# EAGLE schematic scema (EAGLE 7.1.0)
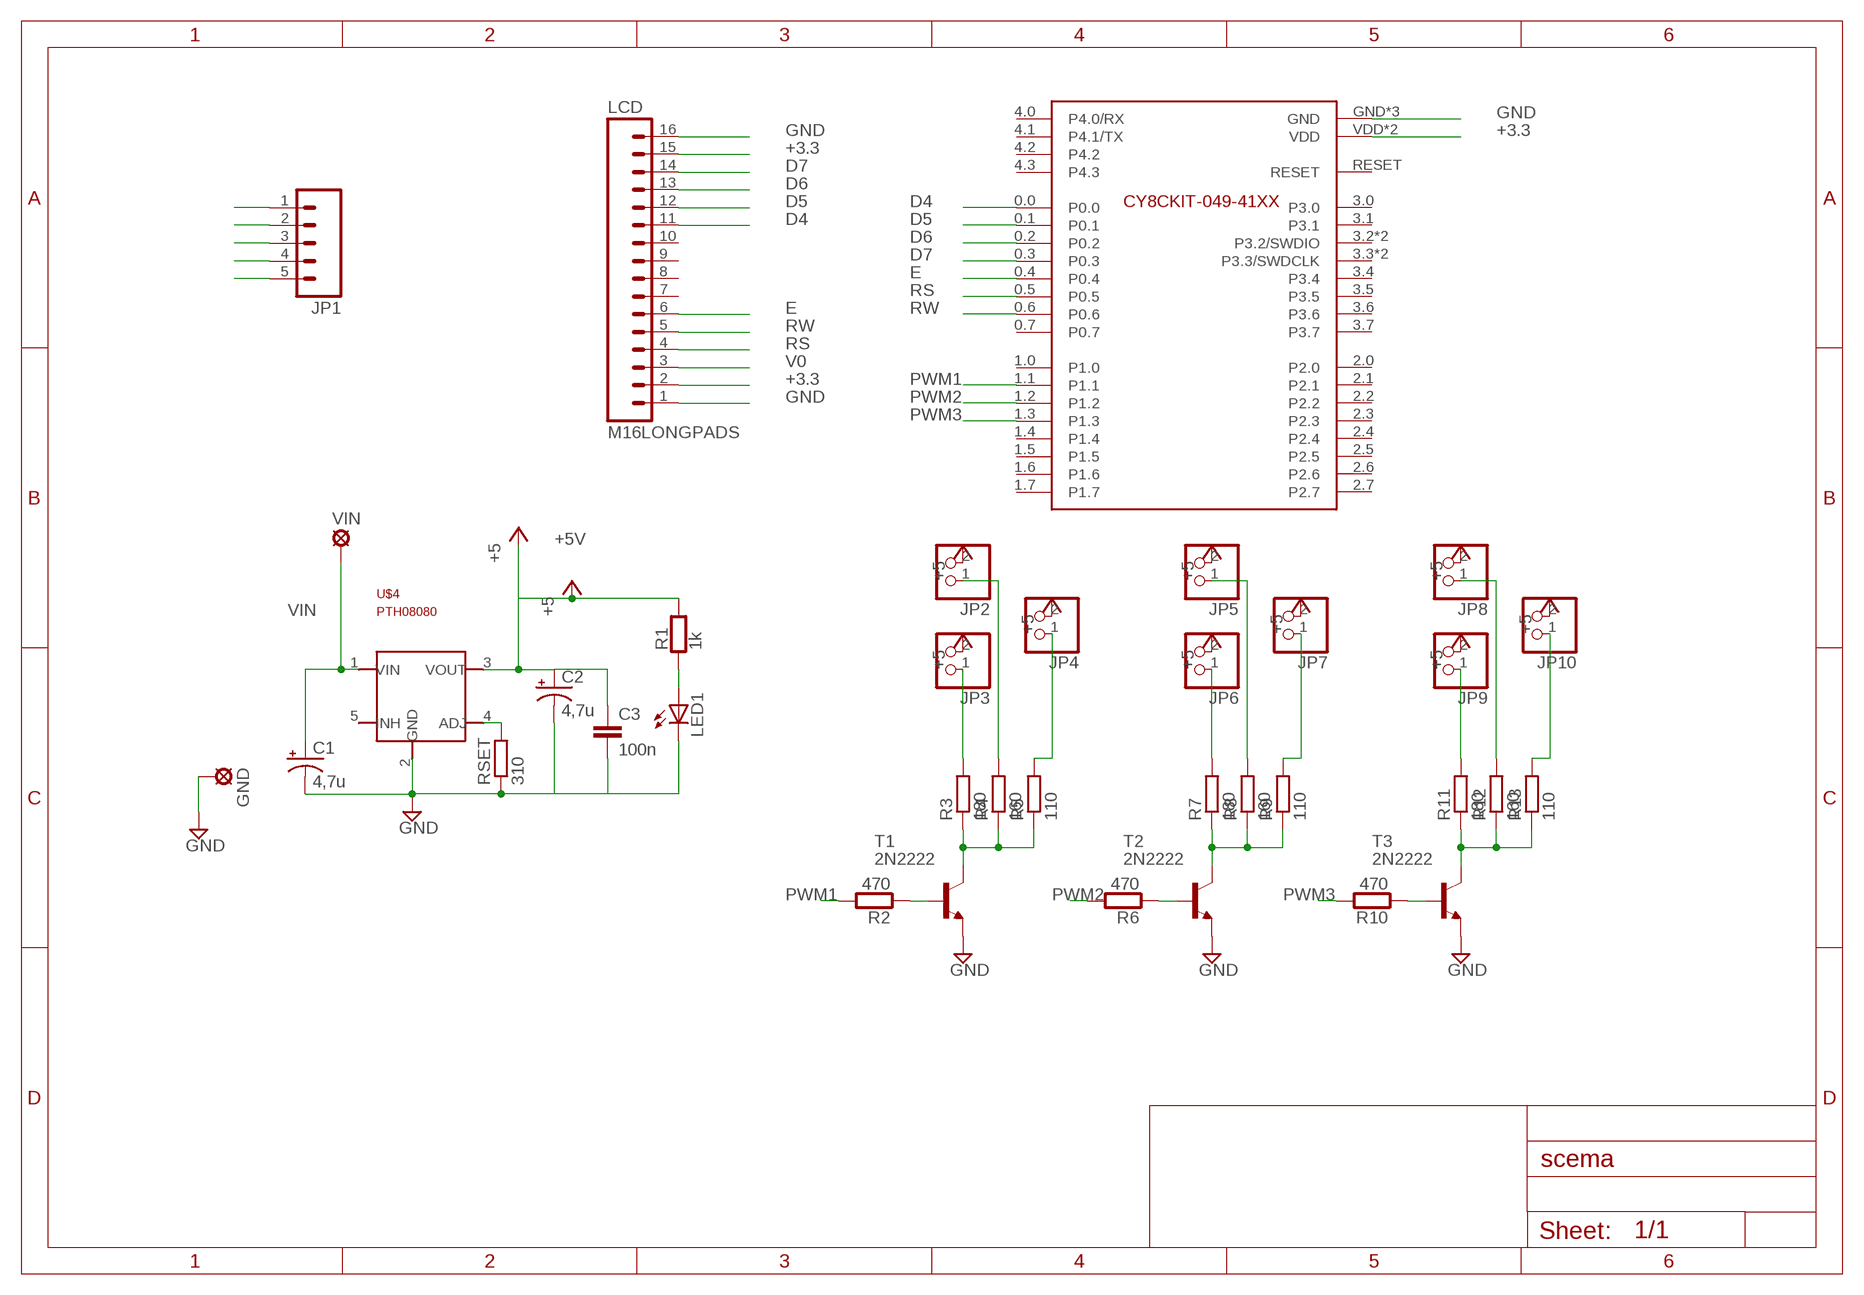
[diagram p0: schematic, sheet 1]

## Parts
C1  4,7u  CAP_POLPTH2  [CPOL-RADIAL-10UF-25V]
C2  4,7u  CAP_POLPTH2  [CPOL-RADIAL-10UF-25V]
C3  100n  CAPPTH2  [CAP-PTH-SMALL2]
GND  SE14  [SE14]
JP1  M05PTH_LONGPADS  [1X05_LONGPADS]
JP2  PINHD-1X2  [1X02]
JP3  PINHD-1X2  [1X02]
JP4  PINHD-1X2  [1X02]
JP5  PINHD-1X2  [1X02]
JP6  PINHD-1X2  [1X02]
JP7  PINHD-1X2  [1X02]
JP8  PINHD-1X2  [1X02]
JP9  PINHD-1X2  [1X02]
JP10  PINHD-1X2  [1X02]
LCD  M16LONGPADS  [1X16_LONGPADS]
LED1  LEDSML0805  [SML0805]
R1  1k  R0805  [0805]
R2  470  R0805  [0805]
R3  180  R-EU_0207/12  [0207/12]
R4  160  R-EU_0207/12  [0207/12]
R5  110  R-EU_0207/12  [0207/12]
R6  470  R0805  [0805]
R7  180  R-EU_0207/12  [0207/12]
R8  160  R-EU_0207/12  [0207/12]
R9  110  R-EU_0207/12  [0207/12]
R10  470  R0805  [0805]
R11  180  R-EU_0207/12  [0207/12]
R12  160  R-EU_0207/12  [0207/12]
R13  110  R-EU_0207/12  [0207/12]
RSET  310  R-EU_R0805  [R0805]
T1  2N2222  [TO18]
T2  2N2222  [TO18]
T3  2N2222  [TO18]
U$1  PSOC4DEV  [CY8CKIT-049-41XX]
U$4  PTH08080  [PTH08080EUF]
VIN  SE14  [SE14]

## Nets
+3.3: JP1.1 LCD.2 LCD.15 U$1.VDD U$1.VDD2(VDD)
+5V [pow]: C2.1(+) C3.1 JP2.2 JP3.2 JP4.2 JP5.2 JP6.2 JP7.2 JP8.2 JP9.2 JP10.2 R1.2 U$4.3(VOUT) ; supply symbol labelled +5
D4: LCD.11 U$1.0.0
D5: LCD.12 U$1.0.1
D6: LCD.13 U$1.0.2
D7: LCD.14 U$1.0.3
E: LCD.6 U$1.0.4
GND [pow]: C1.2(-) C2.2(-) C3.2 GND.MP JP1.2 LCD.1 LCD.16 LED1.C RSET.1 T1.1(E) T2.1(E) T3.1(E) U$1.GND U$1.GND1(GND) U$1.GND2(GND) U$4.2(GND)
N$1: R2.1 T1.2(B)
N$2: R6.1 T2.2(B)
N$5: RSET.2 U$4.4(ADJ)
N$6: JP3.1 R3.2
N$7: R3.1 R4.1 R5.1 T1.3(C)
N$8: JP2.1 R4.2
N$9: JP4.1 R5.2
N$10: JP6.1 R7.2
N$11: R7.1 R8.1 R9.1 T2.3(C)
N$12: LED1.A R1.1
N$13: JP5.1 R8.2
N$14: JP7.1 R9.2
N$15: R10.1 T3.2(B)
N$17: JP9.1 R11.2
N$18: R11.1 R12.1 R13.1 T3.3(C)
N$19: JP8.1 R12.2
N$20: JP10.1 R13.2
PWM1: JP1.3 R2.2 U$1.1.1
PWM2: JP1.4 R6.2 U$1.1.2
PWM3: JP1.5 R10.2 U$1.1.3
RS: LCD.4 U$1.0.5
RW: LCD.5 U$1.0.6
V0: LCD.3
VIN: C1.1(+) U$4.1(VIN) VIN.MP
Unconnected: LCD.7 LCD.8 LCD.9 LCD.10 U$1.0.7 U$1.1.0 U$1.1.4 U$1.1.5 U$1.1.6 U$1.1.7 U$1.2.0 U$1.2.1 U$1.2.2 U$1.2.3 U$1.2.4 U$1.2.5 U$1.2.6 U$1.2.7 U$1.3.0 U$1.3.1 U$1.3.2(P3.2/SWDIO) U$1.3.3(P3.3/SWDCLK) U$1.3.4 U$1.3.5 U$1.3.6 U$1.3.7 U$1.4.0(P4.0/RX) U$1.4.1(P4.1/TX) U$1.4.2 U$1.4.3 U$1.RESET U$1.SWDCLK(P3.3/SWDCLK) U$1.SWDIO(P3.2/SWDIO) U$4.5(INH)

## Library data of the parts
C1 C2 = SparkFun-Passives:CAP_POL: Capacitor Polarized These are standard SMD and PTH capacitors. Normally 10uF, 47uF, and 100uF in electrolytic and tantalum varieties. Always verify the external diameter of the through hole cap, it varies with capacity, voltage, and manufacturer. The EIA devices should be standard.
C3 = SparkFun-Passives:CAP: Capacitor Standard 0603 ceramic capacitor, and 0.1" leaded capacitor.
GND VIN = solpad:SE14: SOLDER PAD E1553, drill 1,4mm, distributor Buerklin, 07F820
JP1 = SparkFun-Connectors:M05: Header 5 Standard 5-pin 0.1" header. Use with straight break away headers (SKU : PRT-00116), right angle break away headers (PRT-00553), swiss pins (PRT-00743), machine pins (PRT-00117), and female headers (PRT-00115). Molex polarized connector foot print use with SKU : PRT-08230 with associated crimp pins and housings.
JP2-JP10 = pinhead:PINHD-1X2: PIN HEADER
LCD = SparkFun-Connectors:M16: 1x16 .1" header
LED1 = led:LED: LED OSRAM: - CHIPLED LG R971, LG N971, LY N971, LG Q971, LY Q971, LO R971, LY R971 LH N974, LH R974 LS Q976, LO Q976, LY Q976 LO Q996 - Hyper CHIPLED LW Q18S LB Q993, LB Q99A, LB R99A - SideLED LS A670, LO A670, LY A670, LG A670, LP A670 LB A673, LV A673, LT A673, LW A673 LH A674 LY A675 LS A676, LA A676, LO A676, LY A676, LW A676 LS A679, LY A679, LG A679 - Hyper Micro SIDELED® LS Y876, LA Y876, LO Y876, LY Y876 LT Y87S - SmartLED LW L88C, LW L88S LB L89C, LB L89S, LG L890 LS L89K, LO L89K, LY L89K LS L896, LA L896, LO L896, LY L896 - TOPLED LS T670, LO T670, LY T670, LG T670, LP T670 LSG T670, LSP T670, LSY T670, LOP T670, LYG T670 LG T671, LOG T671, LSG T671 LB T673, LV T673, LT T673, LW T673 LH T674 LS T676, LA T676, LO T676, LY T676, LB T676, LH T676, LSB T676, LW T676 LB T67C, LV T67C, LT T67C, LS T67K, LO T67K, LY T67K, LW E67C LS E67B, LA E67B, LO E67B, LY E67B, LB E67C, LV E67C, LT E67C LW T67C LS T679, LY T679, LG T679 LS T770, LO T770, LY T770, LG T770, LP T770 LB T773, LV T773, LT T773, LW T773 LH T774 LS E675, LA E675, LY E675, LS T675 LS T776, LA T776, LO T776, LY T776, LB T776 LHGB T686 LT T68C, LB T68C - Hyper Mini TOPLED® LB M676 - Mini TOPLED Santana® LG M470 LS M47K, LO M47K, LY M47K Source: http://www.osram.convergy.de LUXEON: - LUMILED® LXK2-PW12-R00, LXK2-PW12-S00, LXK2-PW14-U00, LXK2-PW14-V00 LXK2-PM12-R00, LXK2-PM12-S00, LXK2-PM14-U00 LXK2-PE12-Q00, LXK2-PE12-R00, LXK2-PE12-S00, LXK2-PE14-T00, LXK2-PE14-U00 LXK2-PB12-K00, LXK2-PB12-L00, LXK2-PB12-M00, LXK2-PB14-N00, LXK2-PB14-P00, LXK2-PB14-Q00 LXK2-PR12-L00, LXK2-PR12-M00, LXK2-PR14-Q00, LXK2-PR14-R00 LXK2-PD12-Q00, LXK2-PD12-R00, LXK2-PD12-S00 LXK2-PH12-R00, LXK2-PH12-S00 LXK2-PL12-P00, LXK2-PL12-Q00, LXK2-PL12-R00 Source: www.luxeon.com KINGBRIGHT: KA-3528ASYC Source: www.kingbright.com
R1 R2 R6 R10 = mbed-rlcq:R
R3-R5 R7-R9 R11-R13 RSET = rcl:R-EU_: RESISTOR, European symbol
T1-T3 = transistor:2N2222: NPN TRANSISTOR
U$1 = PSoC4-devkit:PSOC4DEV
U$4 = PTH08080:PTH08080: DC-DC, Vin 5..18V, Vout 2..6V, 2A www.ti.com

## Net classes
0 VIN: width 0.6 mm
1 pow: width 0.508 mm